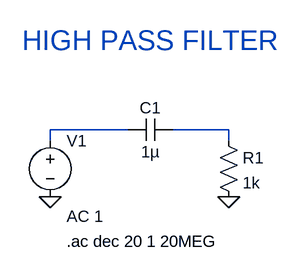
[diagram p0: schematic 2)high_pass_filter.asc]
2)high_pass_filter.asc, the LTspice schematic file:
Version 4
SHEET 1 880 680
WIRE 176 80 64 80
WIRE 320 80 240 80
WIRE 64 96 64 80
WIRE 320 96 320 80
FLAG 320 176 0
FLAG 64 176 0
SYMBOL voltage 64 80 R0
WINDOW 123 24 124 Left 2
WINDOW 39 0 0 Left 0
SYMATTR Value2 AC 1
SYMATTR InstName V1
SYMATTR Value ""
SYMBOL cap 240 64 R90
WINDOW 0 0 32 VBottom 2
WINDOW 3 32 32 VTop 2
SYMATTR InstName C1
SYMATTR Value 1µ
SYMBOL res 304 80 R0
SYMATTR InstName R1
SYMATTR Value 1k
TEXT 88 240 Left 2 !.ac dec 20 1 20MEG
TEXT 24 -48 Left 4 ;HIGH PASS FILTER

The netlist it stands for:
* 2)high_pass_filter.asc
V1 N001 0 AC 1
C1 N002 N001 1µ
R1 N002 0 1k
.ac dec 20 1 20MEG
* HIGH PASS FILTER
.backanno
.end